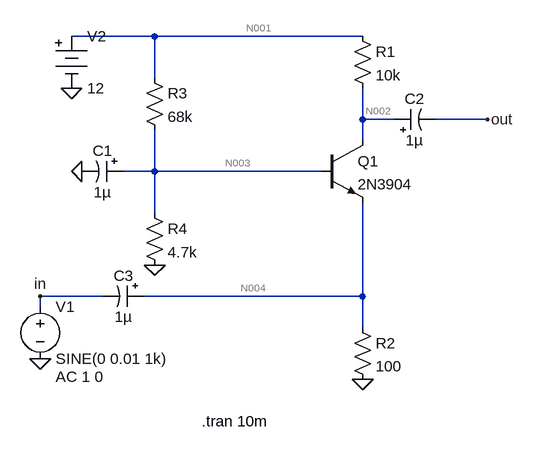
[diagram p0: schematic Voltage Divider Biased Common Emitter Amplifier.asc]
Voltage Divider Biased Common Emitter Amplifier.asc, the LTspice schematic file:
Version 4.1
SHEET 1 1140 680
WIRE 128 64 0 64
WIRE 448 64 128 64
WIRE 128 128 128 64
WIRE 448 192 448 144
WIRE 496 192 448 192
WIRE 640 192 560 192
WIRE 448 224 448 192
WIRE 128 272 128 208
WIRE 128 272 80 272
WIRE 384 272 128 272
WIRE 128 336 128 272
WIRE 48 464 -48 464
WIRE 448 464 448 320
WIRE 448 464 112 464
WIRE -48 480 -48 464
WIRE 448 512 448 464
FLAG 16 272 0
FLAG 128 416 0
FLAG 448 592 0
FLAG -48 560 0
FLAG 640 192 out
FLAG -48 464 in
FLAG 0 144 0
SYMBOL res 432 48 R0
SYMATTR InstName R1
SYMATTR Value 10k
SYMBOL res 432 496 R0
SYMATTR InstName R2
SYMATTR Value 100
SYMBOL res 112 112 R0
SYMATTR InstName R3
SYMATTR Value 68k
SYMBOL res 112 320 R0
SYMATTR InstName R4
SYMATTR Value 4.7k
SYMBOL npn 384 224 R0
SYMATTR InstName Q1
SYMATTR Value 2N3904
SYMBOL polcap 80 256 R90
WINDOW 0 0 32 VBottom 2
WINDOW 3 32 32 VTop 2
SYMATTR InstName C1
SYMATTR Value 1µ
SYMBOL voltage -48 464 R0
WINDOW 123 24 124 Left 2
WINDOW 39 0 0 Left 0
SYMATTR Value2 AC 1 0
SYMATTR InstName V1
SYMATTR Value SINE(0 0.01 1k)
SYMBOL polcap 496 208 R270
WINDOW 0 32 32 VTop 2
WINDOW 3 0 32 VBottom 2
SYMATTR InstName C2
SYMATTR Value 1µ
SYMBOL polcap 112 448 R90
WINDOW 0 0 32 VBottom 2
WINDOW 3 32 32 VTop 2
SYMATTR InstName C3
SYMATTR Value 1µ
SYMBOL Misc\\battery 0 48 R0
WINDOW 123 0 0 Left 0
WINDOW 39 0 0 Left 0
SYMATTR InstName V2
SYMATTR Value 12
TEXT 200 656 Left 2 !.tran 10m

The netlist it stands for:
* Voltage Divider Biased Common Emitter Amplifier.asc
R1 N001 N002 10k
R2 N004 0 100
R3 N001 N003 68k
R4 N003 0 4.7k
Q1 N002 N003 N004 0 2N3904
C1 N003 0 1µ
V1 in 0 SINE(0 0.01 1k) AC 1 0
C2 N002 out 1µ
C3 N004 in 1µ
V2 N001 0 12
.model NPN NPN
.model PNP PNP
.lib standard.bjt
.tran 10m
.backanno
.end

* Results of the author's LTspice run, read from the files saved beside the schematic
* Operating Point, zero values left out:
*   V(n001) = 12 V
*   V(n002) = 1.59 V
*   V(n003) = 760.6 mV
*   V(n004) = 104.4 mV
*   V(out) = 1.59 V
*   I(R1) = 1.041 mA
*   I(R2) = 1.044 mA
*   I(R3) = 165.3 µA
*   I(R4) = 161.8 µA
*   I(V2) = -1.206 mA
*   Ib(Q1) = 3.45 µA
*   Ic(Q1) = 1.041 mA
*   Ie(Q1) = -1.044 mA
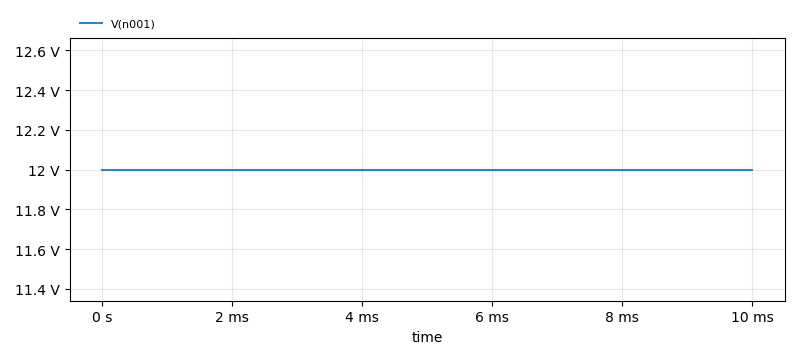
[diagram p1: Transient Analysis of Voltage Divider Biased Common Emitter Amplifier.asc, plotted from the saved traces]
* Transient Analysis, 1 run:
*   V(n001): min 12 V, max 12 V, average 12 V, rms 12 V, last 12 V